# Altium schematic sheet Mach_nguon.SchDoc: Power
size 203 x 127 mm; DrawnBy: Trdat; Revision: V1.0; PageSetup: Record=PageOptions|CenterHorizontal=True|CenterVertical=True|PrintScale=1.00|XCorrection=1.00|YCorrection=1.00|PrintKind=0|BorderSize=5000000|LeftOffset=0|BottomOffset=0|Orientation=2|PaperLength=1000|PaperWidth=1000|Scale=100|PaperSource=7|PrintQuality=-3|MediaType=1|DitherType=10|PrintScaleMode=0|PaperKind=A4|PaperIndex=9
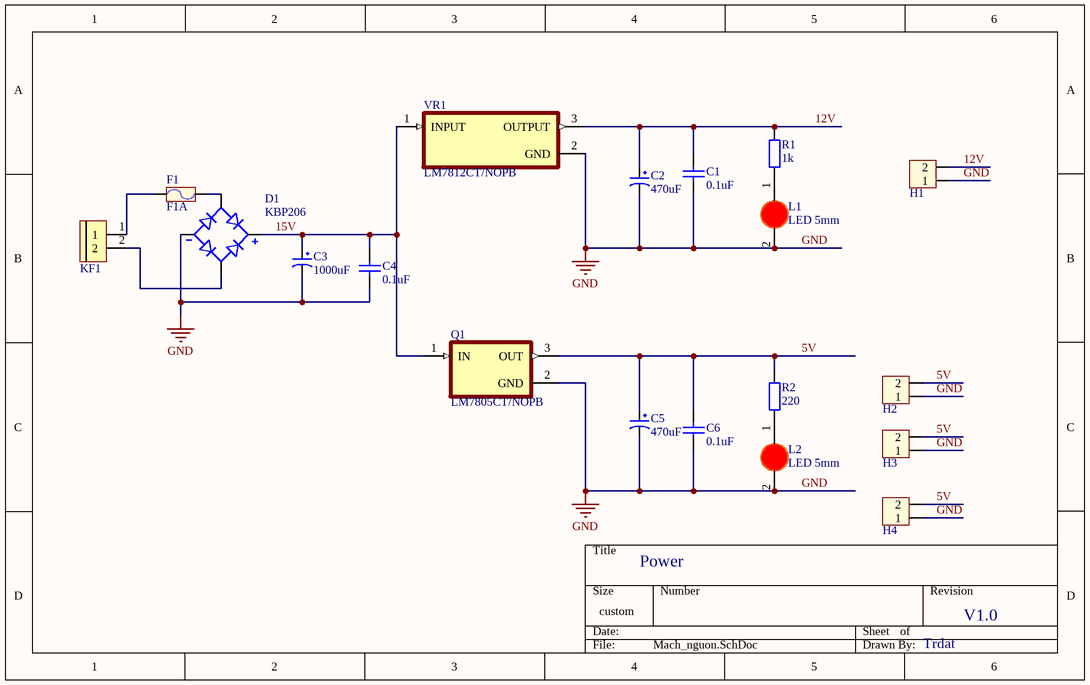
[diagram p0: Mach_nguon.SchDoc]

## Parts
C1  0.1uF  [tu gom]
C2  470uF  [tu hoa 8mm]
C3  1000uF  [tu hoa 8mm]
C4  0.1uF  [tu gom]
C5  470uF  [tu hoa 8mm]
C6  0.1uF  [tu gom]
D1  KBP206  [SIP380W81P386L1470H1270Q4]
F1  F1A  [Fuse1]
H1  Header 2P 2.54 Duc Cong  [Header 2P DC 2.54]  (value not drawn)
H2  Header 2P 2.54 Duc Cong  [Header 2P DC 2.54]  (value not drawn)
H3  Header 2P 2.54 Duc Cong  [Header 2P DC 2.54]  (value not drawn)
H4  Header 2P 2.54 Duc Cong  [Header 2P DC 2.54]  (value not drawn)
KF1  CON 2 KF301  [Con 2 KF301 5.08]  (value not drawn)
L1  LED 5mm  [LED-5MM-RED]
L2  LED 5mm  [LED-5MM-RED]
Q1  LM7805CT/NOPB  [TO254P1054X470X2600-3]
R1  1k  [tro vach 1/2w]
R2  220  [tro vach 1/2w]
VR1  LM7812CT/NOPB  [TO254P1054X470X1955-3]

## Nets
GND: C1.2 C2.2 C3.2 C4.2 C5.2 C6.2 D1.4(NEG) H1.1 H2.1 H3.1 H4.1 L1.2(K) L2.2(K) Q1.2(GND) VR1.2(GND)
5V: C5.1 C6.1 H2.2 H3.2 H4.2 Q1.3(OUT) R2.2
12V: C1.1 C2.1 H1.2 R1.2 VR1.3(OUTPUT)
15V: C3.1 C4.1 D1.1(POS) Q1.1(IN) VR1.1(INPUT)
NetD1_2: D1.2(AC1) KF1.2
NetD1_3: D1.3(AC2) F1.2
NetF1_1: F1.1 KF1.1
NetL1_1: L1.1(A) R1.1
NetL2_1: L2.1(A) R2.1

## Library data of the parts
C1 C4 C6 = Tu gom 100 50V: Cắm; Don_Vi: Con; So_Chan: 2; Ten_Linh_Kien: Tụ gốm 100 10pF 50V; Ma_Hang: MH004765; Chung_Loai: Cắm; Kieu_Chan: *
C2 C5 = Tu Hoa 470uF 16V 8x11: Cắm; Don_Vi: Con; So_Chan: 2; Ten_Linh_Kien: Tụ Hóa 470uF 16V 8x11MM; Ma_Hang: MH006550; Chung_Loai: Cắm; Kieu_Chan: *
C3 = Tu Hoa 1000uF 16V 8x20: Cắm; Don_Vi: Con; So_Chan: 2; Ten_Linh_Kien: Tụ Hóa 1000uF 16V 8x20MM; Ma_Hang: MH008300; Chung_Loai: Cắm; Kieu_Chan: *
D1 = KBP206: ÛŒÚ©Ø³Ùˆ Ú©Ù†Ù†Ø¯Ù‡ Ù¾Ù„ ØªÚ© ÙØ§Ø² Ø§Ø³ØªØ§Ù†Ø¯Ø§Ø±Ø¯ 600 ÙˆÙ„Øª Ø§Ø² Ø·Ø±ÛŒÙ‚ Ø³ÙˆØ±Ø§Ø® KBP; MF: GeneSiC Semiconductor; SnapEDA_Link: https://www.snapeda.com/parts/KBP206/GeneSiC+Semiconductor/view-part/?ref=snap; Package: SIP-4 GeneSiC Semiconductor; Value: *; MP: KBP206; Check_prices: https://www.snapeda.com/parts/KBP206/GeneSiC+Semiconductor/view-part/?ref=eda
F1 = Fuse: Designed by: VanDungEvn; Value: Fuse
H1-H4 = Header 2P 2.54 Duc Cong: Cắm; Ten_Linh_Kien: Header 2P XH2.54-2P Đực Cong; Don_Vi: Con; Ma_Hang: MH002852; Chung_Loai: Cắm
KF1 = CON 2 KF301: Cắm; Ma_Hang: MH000987; Ten_Linh_Kien: CON 2 KF301-2P 5.08MM Xanh Dương; Chung_Loai: Cắm; Ghi_Chu: *; Kieu_Chan: *; Don_Vi: Con
L1 L2 = LED 5mm Do: Cắm; Don_Vi: Con; Ma_Hang: MH008967; Ten_Linh_Kien: Led 5MM Phủ Đỏ (1000c); Ghi_Chu: *; Kieu_Chan: *; Chung_Loai: Cắm
Q1 = LM7805CT/NOPB: Linear Voltage Regulator IC Positive Fixed 1 Output 1.5A TO-220-3; MF: ON Semiconductor; Purchase-URL: https://pricing.snapeda.com/search/part/LM7805CT/?ref=eda; Check_prices: https://www.snapeda.com/parts/LM7805CT/Onsemi/view-part/?ref=eda; SnapEDA_Link: https://www.snapeda.com/parts/LM7805CT/Onsemi/view-part/?ref=snap; Price: None; Availability: In Stock; Package: TO-220-3 ON Semiconductor; MP: LM7805CT; Value: *
R1 R2 = Tro Vach 1/2W 5% 1k: Cắm; Don_Vi: Con; So_Chan: 2; Ten_Linh_Kien: Trở 5% 1/2w 1K; Ma_Hang: MH007240; Chung_Loai: Cắm; Kieu_Chan: *
VR1 = LM7812CT/NOPB: 1.5-A, 30-V, linear voltage regulator; MF: Texas Instruments; SnapEDA_Link: https://www.snapeda.com/parts/LM7812CT/NOPB/Texas+Instruments/view-part/?ref=snap; Package: TO-220-3 Texas Instruments; Value: *; MP: LM7812CT/NOPB; Check_prices: https://www.snapeda.com/parts/LM7812CT/NOPB/Texas+Instruments/view-part/?ref=eda